# EAGLE schematic v1.0 (EAGLE 7.1.0)
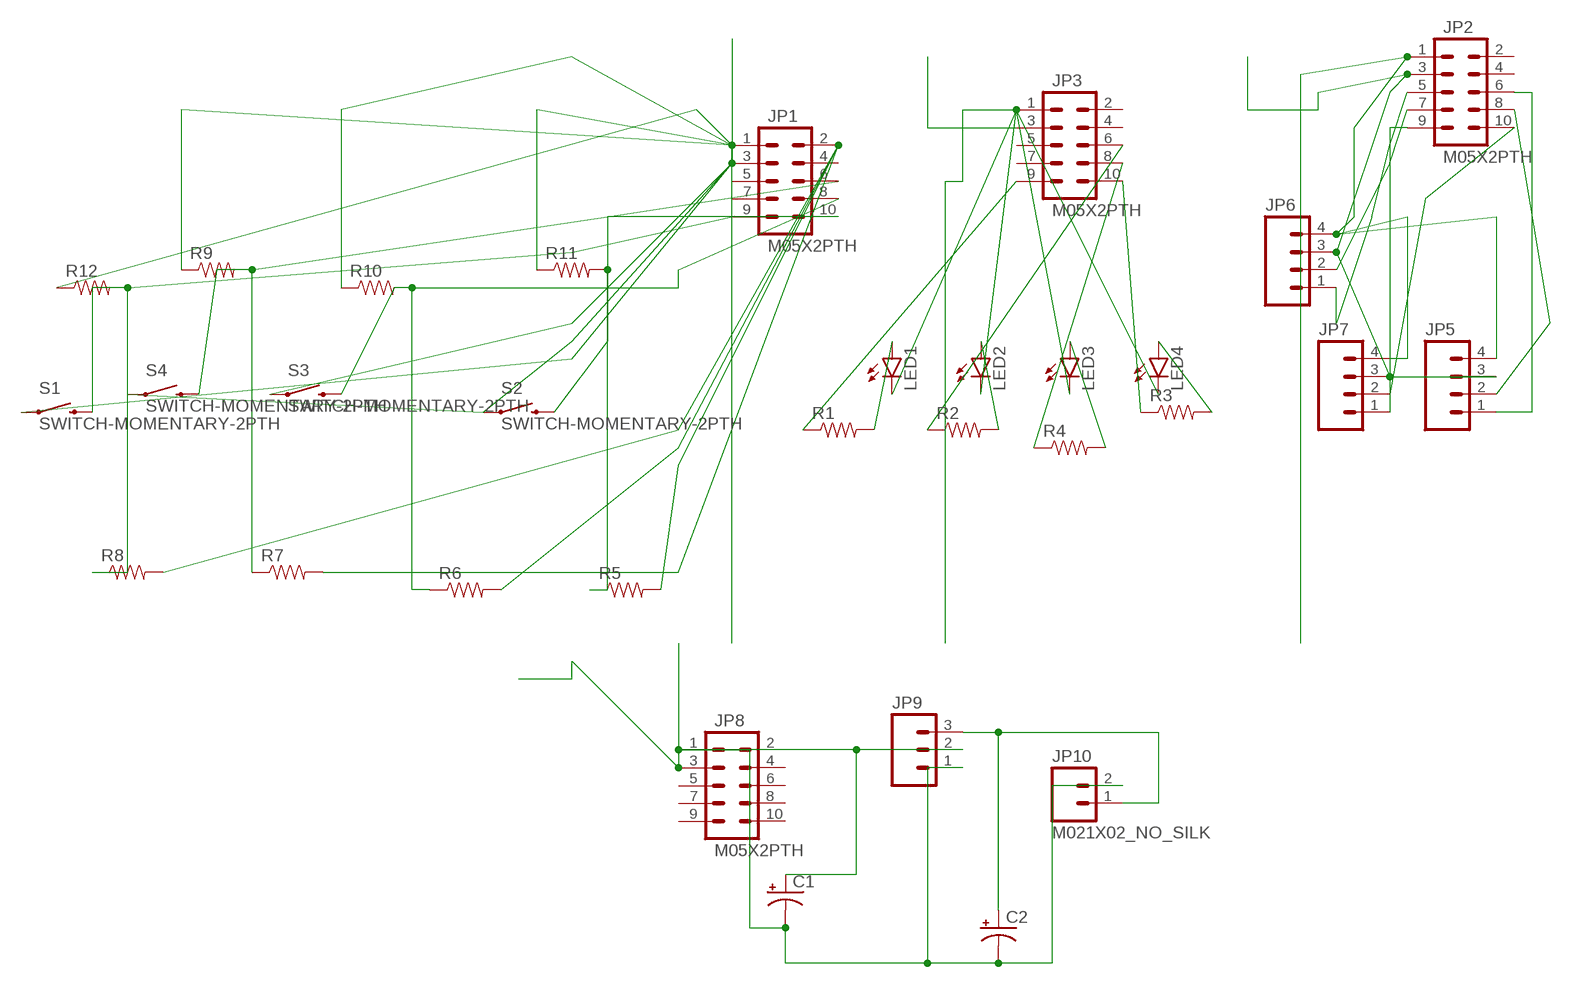
[diagram p0: schematic, sheet 1]

## Parts
C1  CAP_POLPTH2  [CPOL-RADIAL-10UF-25V]
C2  CAP_POLPTH2  [CPOL-RADIAL-10UF-25V]
JP1  M05X2PTH  [AVR_ICSP]
JP2  M05X2PTH  [AVR_ICSP]
JP3  M05X2PTH  [AVR_ICSP]
JP5  M04POLAR  [MOLEX-1X4]
JP6  M04POLAR  [MOLEX-1X4]
JP7  M04POLAR  [MOLEX-1X4]
JP8  M05X2PTH  [AVR_ICSP]
JP9  M031X03_NO_SILK  [1X03_NO_SILK]
JP10  M021X02_NO_SILK  [1X02_NO_SILK]
LED1  LED3MM  [LED3MM]
LED2  LED3MM  [LED3MM]
LED3  LED3MM  [LED3MM]
LED4  LED3MM  [LED3MM]
R1  RESISTORPTH-1/4W-VERT  [AXIAL-0.1]
R2  RESISTORPTH-1/4W-VERT  [AXIAL-0.1]
R3  RESISTORPTH-1/4W-VERT  [AXIAL-0.1]
R4  RESISTORPTH-1/4W-VERT  [AXIAL-0.1]
R5  RESISTORPTH-1/4W-VERT  [AXIAL-0.1]
R6  RESISTORPTH-1/4W-VERT  [AXIAL-0.1]
R7  RESISTORPTH-1/4W-VERT  [AXIAL-0.1]
R8  RESISTORPTH-1/4W-VERT  [AXIAL-0.1]
R9  RESISTORPTH-1/4W-VERT  [AXIAL-0.1]
R10  RESISTORPTH-1/4W-VERT  [AXIAL-0.1]
R11  RESISTORPTH-1/4W-VERT  [AXIAL-0.1]
R12  RESISTORPTH-1/4W-VERT  [AXIAL-0.1]
S1  SWITCH-MOMENTARY-2PTH  [TACTILE-PTH]
S2  SWITCH-MOMENTARY-2PTH  [TACTILE-PTH]
S3  SWITCH-MOMENTARY-2PTH  [TACTILE-PTH]
S4  SWITCH-MOMENTARY-2PTH  [TACTILE-PTH]

## Nets
GND1: C1.2(-) C2.2(-) JP8.1 JP9.1 JP10.2
GND2: JP3.1 LED1.K(C) LED2.K(C) LED3.K(C) LED4.K(C)
GND3: JP1.1 R9.P$1 R10.P$1 R11.P$1 R12.P$1
GND4: JP2.1 JP5.4 JP6.4 JP7.4
N$1: JP2.5 JP6.1
N$2: JP2.7 JP6.2
N$3: JP1.6 R7.P$1 R9.P$2 S4.3
N$4: JP1.8 R6.P$1 R10.P$2 S3.3
N$5: JP1.9 R8.P$1 R12.P$2 S1.3
N$6: JP1.2 R5.P$2 R6.P$2 R7.P$2 R8.P$2
N$7: JP2.8 JP5.2
N$8: LED4.A R3.P$2
N$9: LED3.A R4.P$2
N$10: LED2.A R2.P$2
N$11: LED1.A R1.P$2
N$12: JP3.9 R1.P$1
N$13: JP3.6 R2.P$1
N$14: JP3.8 R4.P$1
N$15: JP3.10 R3.P$1
N$16: JP1.10 R5.P$1 R11.P$2 S2.3
N$17: JP2.6 JP5.1
N$18: JP2.10 JP7.2
N$19: JP2.9 JP7.1
N$21: C2.1(+) JP9.3 JP10.1
VCC1: C1.1(+) JP8.3 JP9.2
VCC2: JP3.3
VCC3: JP1.3 S1.1 S2.1 S3.1 S4.1
VCC4: JP2.3 JP5.3 JP6.3 JP7.3
Unconnected: JP1.4 JP1.5 JP1.7 JP2.2 JP2.4 JP3.2 JP3.4 JP3.5 JP3.7 JP8.2 JP8.4 JP8.5 JP8.6 JP8.7 JP8.8 JP8.9 JP8.10

## Library data of the parts
C1 C2 = SparkFun-Capacitors:CAP_POL: Capacitor Polarized These are standard SMD and PTH capacitors. Normally 10uF, 47uF, and 100uF in electrolytic and tantalum varieties. Always verify the external diameter of the through hole cap, it varies with capacity, voltage, and manufacturer. The EIA devices should be standard.
JP1-JP3 JP8 = SparkFun-Connectors:M05X2: Header 5x2 Standard 10-pin dual row 0.1" header. Commonly used with AVR-ISP. Use with Spark Fun Electronics SKU: PRT-00778
JP5-JP7 = SparkFun-Connectors:M04: Header 4 Standard 4-pin 0.1" header. Use with straight break away headers (SKU : PRT-00116), right angle break away headers (PRT-00553), swiss pins (PRT-00743), machine pins (PRT-00117), and female headers (PRT-00115). Molex polarized connector foot print use with SKU : PRT-08231 with associated crimp pins and housings. 1MM SMD Version SKU: PRT-10208
JP9 = SparkFun-Connectors:M03: Header 3 Standard 3-pin 0.1" header. Use with straight break away headers (SKU : PRT-00116), right angle break away headers (PRT-00553), swiss pins (PRT-00743), machine pins (PRT-00117), and female headers (PRT-00115). Molex polarized connector foot print use with SKU : PRT-08232 with associated crimp pins and housings.
JP10 = SparkFun-Connectors:M02: Standard 2-pin 0.1" header. Use with - straight break away headers ( PRT-00116) - right angle break away headers (PRT-00553) - swiss pins (PRT-00743) - machine pins (PRT-00117) - female headers (PRT-00115) Molex polarized connector foot print use with: PRT-08233 with associated crimp pins and housings. 2.54_SCREWTERM for use with PRT-10571. 3.5mm Screw Terminal footprints for PRT-08084 5mm Screw Terminal footprints for use with PRT-08432
LED1-LED4 = SparkFun-LED:LED: LEDs Standard schematic elements and footprints for 5mm, 3mm, 1206, and 0603 sized LEDs. 5mm - Spark Fun Electronics SKU : COM-00529 (and others)
R1-R12 = SparkFun-Resistors:RESISTOR: Resistor Basic schematic elements and footprints for 0603, 1206, and PTH resistors.
S1-S4 = SparkFun-Electromechanical:SWITCH-MOMENTARY-2: Various NO switches- pushbuttons, reed, etc